# EAGLE design Altaids (EAGLE 7.6.0)
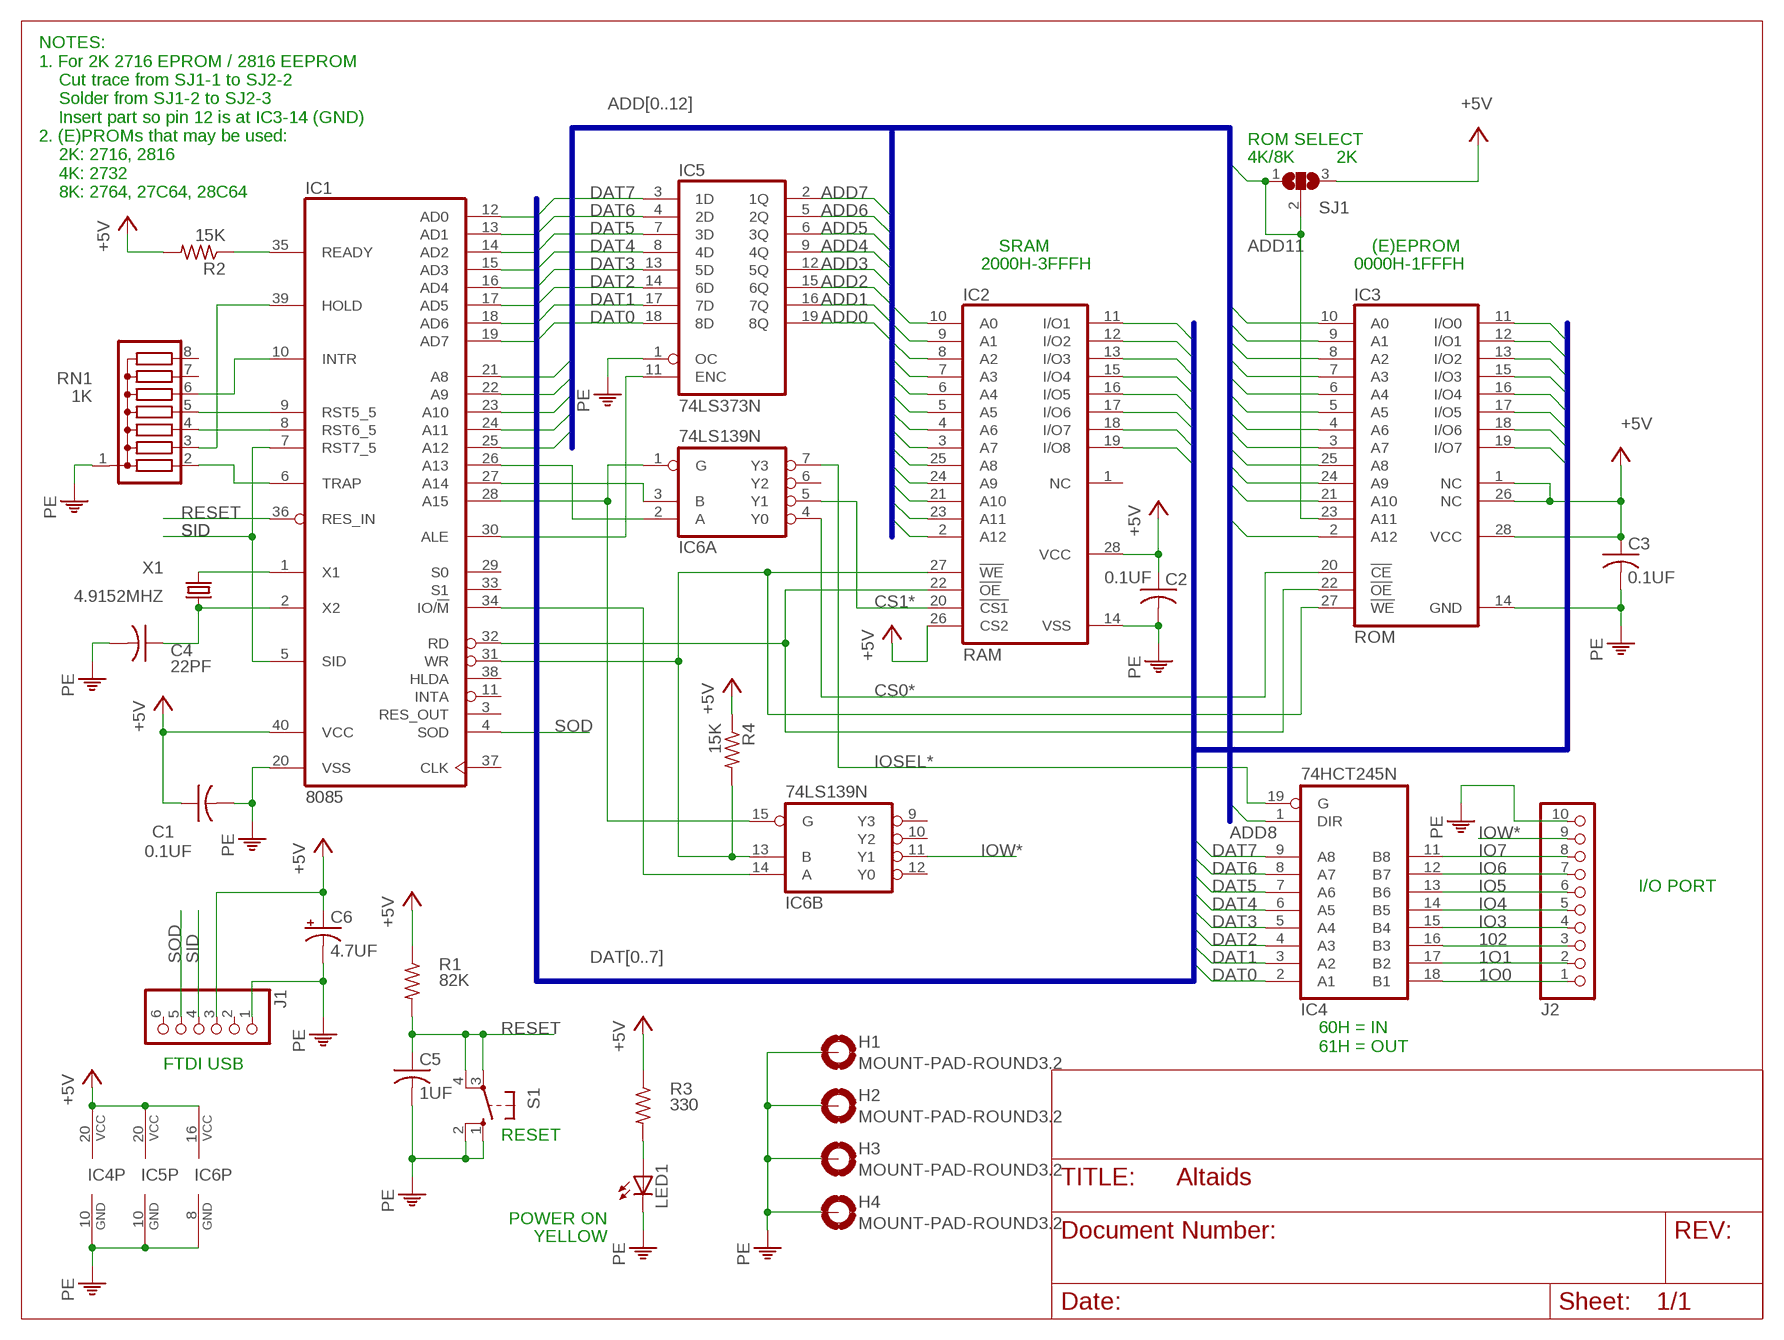
[diagram p0: schematic, sheet 1]

## Parts
C1  0.1UF  C-US025-025X050  [C025-025X050]
C2  0.1UF  C-US025-025X050  [C025-025X050]
C3  0.1UF  C-US025-025X050  [C025-025X050]
C4  22PF  C-US025-025X050  [C025-025X050]
C5  1UF  C-US025-025X050  [C025-025X050]
C6  4.7UF  CAP_POLPTH1  [CPOL-RADIAL-100UF-25V]
H1  MOUNT-PAD-ROUND3.2  [3,2-PAD]
H2  MOUNT-PAD-ROUND3.2  [3,2-PAD]
H3  MOUNT-PAD-ROUND3.2  [3,2-PAD]
H4  MOUNT-PAD-ROUND3.2  [3,2-PAD]
IC1  8085  [DIL40]
IC2  RAM  6264A  [DIL28-6]
IC3  ROM  28C64C  [DIL28-6]
IC4  74HCT245N  74LS245N  [DIL20]
IC5  74LS373N  [DIL20]
IC6  74LS139N  [DIL16]
J1  PINHD-1X6  [1X06]
J2  PINHD-1X10  [1X10]
LED1  LED3MM  [LED3MM]
R1  82K  R-US_0207/10  [0207/10]
R2  15K  R-US_0207/10  [0207/10]
R3  330  R-US_0207/10  [0207/10]
R4  15K  R-US_0207/10  [0207/10]
RN1  1K  G07R  [SIL8]
S1  10-XX  [B3F-10XX]
SJ1  SJ2W  [SJ_2]
X1  4.9152MHZ  CRYSTALHC49U-H  [HC49U-H]

## Nets
1O0: IC4.18(B1) J2.1
1O1: IC4.17(B2) J2.2
102: IC4.16(B3) J2.3
+5V: C1.1 C2.1 C3.1 C6.1(+) IC1.40(VCC) IC2.26(CS2) IC2.28(VCC) IC3.1(NC) IC3.26(NC) IC3.28(VCC) IC4.20(VCC) IC5.20(VCC) IC6.16(P:VCC) J1.3 R1.1 R2.2 R3.1 R4.1 SJ1.3
ADD0: IC2.10(A0) IC3.10(A0) IC5.19(8Q)
ADD1: IC2.9(A1) IC3.9(A1) IC5.16(7Q)
ADD2: IC2.8(A2) IC3.8(A2) IC5.15(6Q)
ADD3: IC2.7(A3) IC3.7(A3) IC5.12(5Q)
ADD4: IC2.6(A4) IC3.6(A4) IC5.9(4Q)
ADD5: IC2.5(A5) IC3.5(A5) IC5.6(3Q)
ADD6: IC2.4(A6) IC3.4(A6) IC5.5(2Q)
ADD7: IC2.3(A7) IC3.3(A7) IC5.2(1Q)
ADD8: IC1.21(A8) IC2.25(A8) IC3.25(A8) IC4.1(DIR)
ADD9: IC1.22(A9) IC2.24(A9) IC3.24(A9)
ADD10: IC1.23(A10) IC2.21(A10) IC3.21(A10)
ADD11: IC1.24(A11) IC2.23(A11) IC3.23(A11) SJ1.1 SJ1.2
ADD12: IC1.25(A12) IC2.2(A12) IC3.2(A12)
CS0*: IC3.20(!CE) IC6.4(A:Y0)
CS1*: IC2.20(!CS1) IC6.5(A:Y1)
DAT0: IC1.12(AD0) IC2.11(I/O1) IC3.11(I/O0) IC4.2(A1) IC5.18(8D)
DAT1: IC1.13(AD1) IC2.12(I/O2) IC3.12(I/O1) IC4.3(A2) IC5.17(7D)
DAT2: IC1.14(AD2) IC2.13(I/O3) IC3.13(I/O2) IC4.4(A3) IC5.14(6D)
DAT3: IC1.15(AD3) IC2.15(I/O4) IC3.15(I/O3) IC4.5(A4) IC5.13(5D)
DAT4: IC1.16(AD4) IC2.16(I/O5) IC3.16(I/O4) IC4.6(A5) IC5.8(4D)
DAT5: IC1.17(AD5) IC2.17(I/O6) IC3.17(I/O5) IC4.7(A6) IC5.7(3D)
DAT6: IC1.18(AD6) IC2.18(I/O7) IC3.18(I/O6) IC4.8(A7) IC5.4(2D)
DAT7: IC1.19(AD7) IC2.19(I/O8) IC3.19(I/O7) IC4.9(A8) IC5.3(1D)
IO3: IC4.15(B4) J2.4
IO4: IC4.14(B5) J2.5
IO5: IC4.13(B6) J2.6
IO6: IC4.12(B7) J2.7
IO7: IC4.11(B8) J2.8
IOSEL*: IC4.19(G) IC6.7(A:Y3)
IOW*: IC6.11(B:Y1) J2.9
N$1: IC1.35(READY) R2.1
N$2: IC1.39(HOLD) RN1.3
N$3: IC1.10(INTR) RN1.6
N$4: IC1.9(RST5_5) RN1.5
N$5: IC1.8(RST6_5) RN1.4
N$6: IC1.6(TRAP) RN1.2
N$7: IC1.28(A15) IC6.1(A:G) IC6.15(B:G)
N$8: IC1.31(WR) IC2.27(!WE) IC3.27(!WE) IC6.13(B:B) R4.2
N$16: LED1.A R3.2
N$17: C4.1 IC1.2(X2) X1.1
N$18: IC1.1(X1) X1.2
N$20: IC1.34(IO/!M) IC6.14(B:A)
N$21: IC1.30(ALE) IC5.11(ENC)
N$23: IC1.27(A14) IC6.3(A:B)
N$24: IC1.26(A13) IC6.2(A:A)
N$25: IC1.32(RD) IC2.22(!OE) IC3.22(!OE)
PE: C1.2 C2.2 C3.2 C4.2 C5.2 C6.2(-) H1.B3,2(MOUNT) H2.B3,2(MOUNT) H3.B3,2(MOUNT) H4.B3,2(MOUNT) IC1.20(VSS) IC2.14(VSS) IC3.14(GND) IC4.10(GND) IC5.1(OC) IC5.10(GND) IC6.8(P:GND) J1.1 J2.10 LED1.K(C) RN1.1 S1.1(S) S1.2(S1)
RESET: C5.1 IC1.36(RES_IN) R1.2 S1.3(P) S1.4(P1)
SID: IC1.5(SID) IC1.7(RST7_5) J1.4
SOD: IC1.4(SOD) J1.5
Unconnected: IC1.3(RES_OUT) IC1.11(INTA) IC1.29(S0) IC1.33(S1) IC1.37(CLK) IC1.38(HLDA) IC2.1(NC) IC6.6(A:Y2) IC6.9(B:Y3) IC6.10(B:Y2) IC6.12(B:Y0) J1.2 J1.6 RN1.7 RN1.8

## Buses
ADD[0..12]
DAT[0..7]

## Notes on the sheet
- ROM SELECT
- 4K/8K | 2K
- NOTES:
  1. For 2K 2716 EPROM / 2816 EEPROM
      Cut trace from SJ1-1 to SJ2-2
      Solder from SJ1-2 to SJ2-3
      Insert part so pin 12 is at IC3-14 (GND)
  2. (E)PROMs that may be used:
      2K: 2716, 2816
      4K: 2732
      8K: 2764, 27C64, 28C64
- SRAM | (E)EPROM
- 2000H-3FFFH | 0000H-1FFFH
- I/O PORT
- 60H = IN
  61H = OUT
- FTDI USB
- RESET
- POWER ON
- YELLOW

## Library data of the parts
C1-C5 = rcl:C-US: CAPACITOR, American symbol
C6 = SparkFun-Capacitors:CAP_POL: Capacitor Polarized These are standard SMD and PTH capacitors. Normally 10uF, 47uF, and 100uF in electrolytic and tantalum varieties. Always verify the external diameter of the through hole cap, it varies with capacity, voltage, and manufacturer. The EIA devices should be standard.
H1-H4 = holes:MOUNT-PAD-ROUND: MOUNTING PAD, round
IC1 = micro-intel:8085: MICROCOMPUTER/PERIPHERAL DEVICE; OC_FARNELL: unknown; OC_NEWARK: unknown
IC2 = memory-hitachi:6264A: MEMORY; OC_FARNELL: 283605; OC_NEWARK: unknown
IC3 = memory-nec:28C64C: MEMORY; MPN: AT28C64B-15PU; OC_FARNELL: 1095784; OC_NEWARK: 96K6557
IC4 = 74xx-us:74*245: Octal BUS TRANSCEIVER, 3-state
IC5 = 74xx-us:74*373: Octal D type transparent LATCH, edge triggered
IC6 = 74xx-us:74*139: Dual 2-line to 4-line DECODER/DEMULTIPLEXER
J1 = pinhead:PINHD-1X6: PIN HEADER
J2 = pinhead:PINHD-1X10: PIN HEADER
LED1 = led:LED: LED OSRAM: - CHIPLED LG R971, LG N971, LY N971, LG Q971, LY Q971, LO R971, LY R971 LH N974, LH R974 LS Q976, LO Q976, LY Q976 LO Q996 - Hyper CHIPLED LW Q18S LB Q993, LB Q99A, LB R99A - SideLED LS A670, LO A670, LY A670, LG A670, LP A670 LB A673, LV A673, LT A673, LW A673 LH A674 LY A675 LS A676, LA A676, LO A676, LY A676, LW A676 LS A679, LY A679, LG A679 - Hyper Micro SIDELED® LS Y876, LA Y876, LO Y876, LY Y876 LT Y87S - SmartLED LW L88C, LW L88S LB L89C, LB L89S, LG L890 LS L89K, LO L89K, LY L89K LS L896, LA L896, LO L896, LY L896 - TOPLED LS T670, LO T670, LY T670, LG T670, LP T670 LSG T670, LSP T670, LSY T670, LOP T670, LYG T670 LG T671, LOG T671, LSG T671 LB T673, LV T673, LT T673, LW T673 LH T674 LS T676, LA T676, LO T676, LY T676, LB T676, LH T676, LSB T676, LW T676 LB T67C, LV T67C, LT T67C, LS T67K, LO T67K, LY T67K, LW E67C LS E67B, LA E67B, LO E67B, LY E67B, LB E67C, LV E67C, LT E67C LW T67C LS T679, LY T679, LG T679 LS T770, LO T770, LY T770, LG T770, LP T770 LB T773, LV T773, LT T773, LW T773 LH T774 LS E675, LA E675, LY E675, LS T675 LS T776, LA T776, LO T776, LY T776, LB T776 LHGB T686 LT T68C, LB T68C - Hyper Mini TOPLED® LB M676 - Mini TOPLED Santana® LG M470 LS M47K, LO M47K, LY M47K Source: http://www.osram.convergy.de LUXEON: - LUMILED® LXK2-PW12-R00, LXK2-PW12-S00, LXK2-PW14-U00, LXK2-PW14-V00 LXK2-PM12-R00, LXK2-PM12-S00, LXK2-PM14-U00 LXK2-PE12-Q00, LXK2-PE12-R00, LXK2-PE12-S00, LXK2-PE14-T00, LXK2-PE14-U00 LXK2-PB12-K00, LXK2-PB12-L00, LXK2-PB12-M00, LXK2-PB14-N00, LXK2-PB14-P00, LXK2-PB14-Q00 LXK2-PR12-L00, LXK2-PR12-M00, LXK2-PR14-Q00, LXK2-PR14-R00 LXK2-PD12-Q00, LXK2-PD12-R00, LXK2-PD12-S00 LXK2-PH12-R00, LXK2-PH12-S00 LXK2-PL12-P00, LXK2-PL12-Q00, LXK2-PL12-R00 Source: www.luxeon.com KINGBRIGHT: KA-3528ASYC Source: www.kingbright.com
R1-R4 = rcl:R-US_: RESISTOR, American symbol
RN1 = resistor-sil:G07R: SIL RESISTOR; OC_FARNELL: unknown; OC_NEWARK: unknown
S1 = switch-omron:10-XX: OMRON SWITCH; MPN: B3F-1000; OC_FARNELL: 176432; OC_NEWARK: 36M3542
SJ1 = jumper:SJ2W: SMD solder JUMPER
X1 = crystal:CRYSTAL: CRYSTAL; OC_FARNELL: 1666973; OC_NEWARK: unknown

## Board
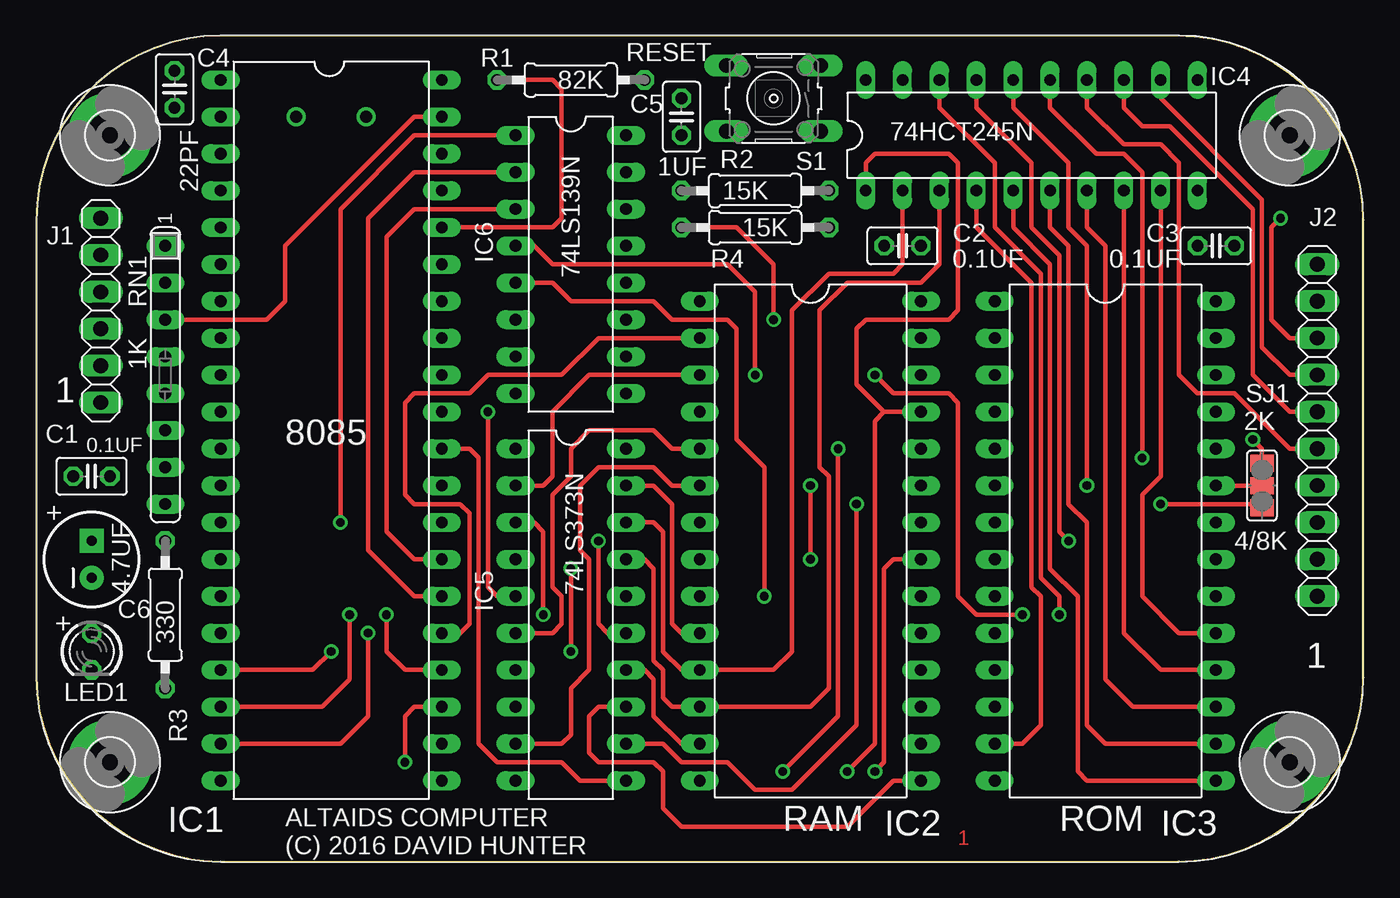
[diagram p1: board, top side]
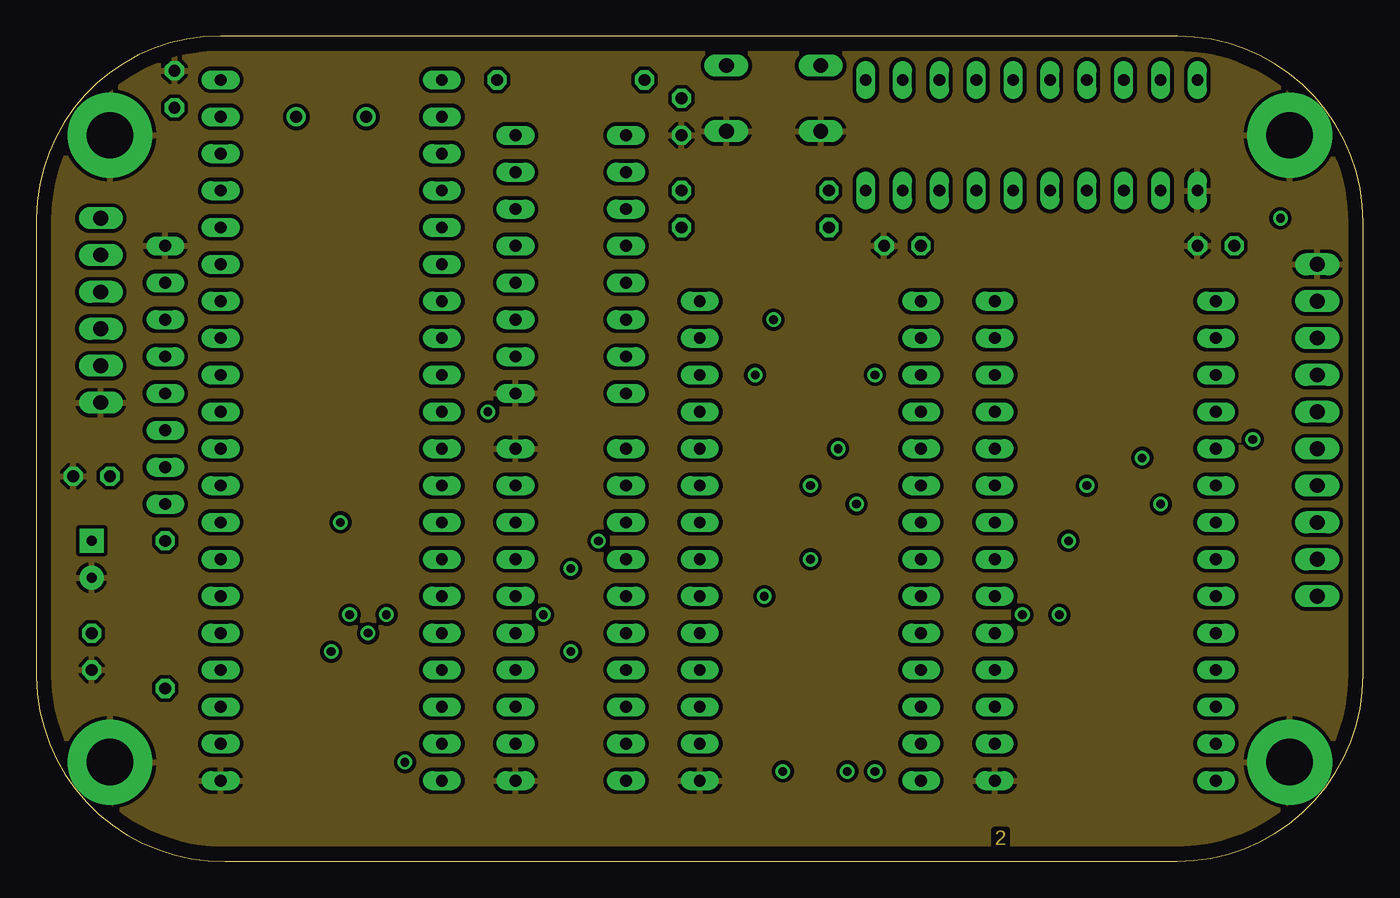
[diagram p2: board, inner layer Route2]
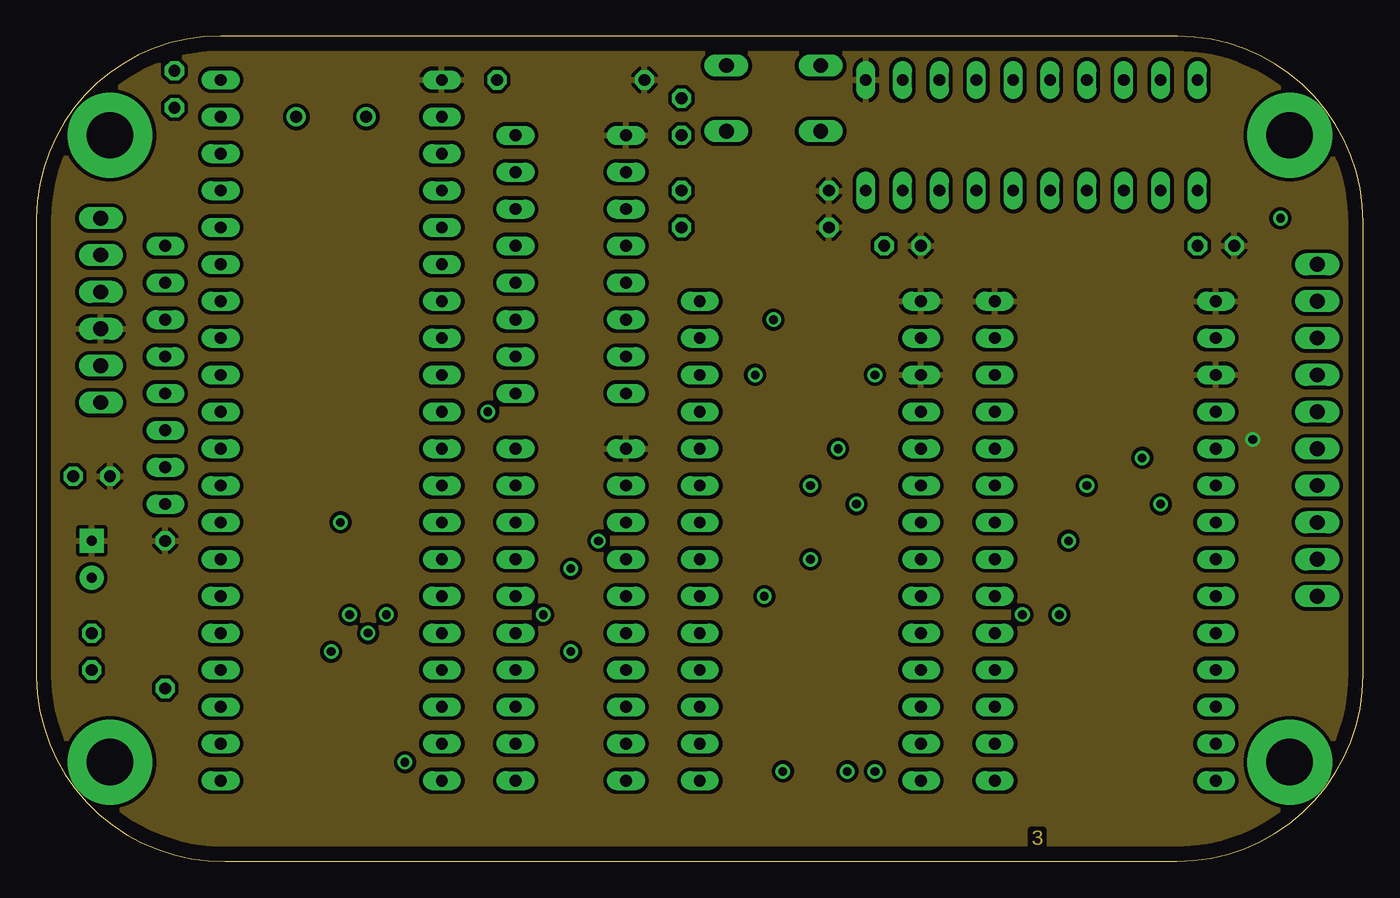
[diagram p3: board, inner layer Route15]
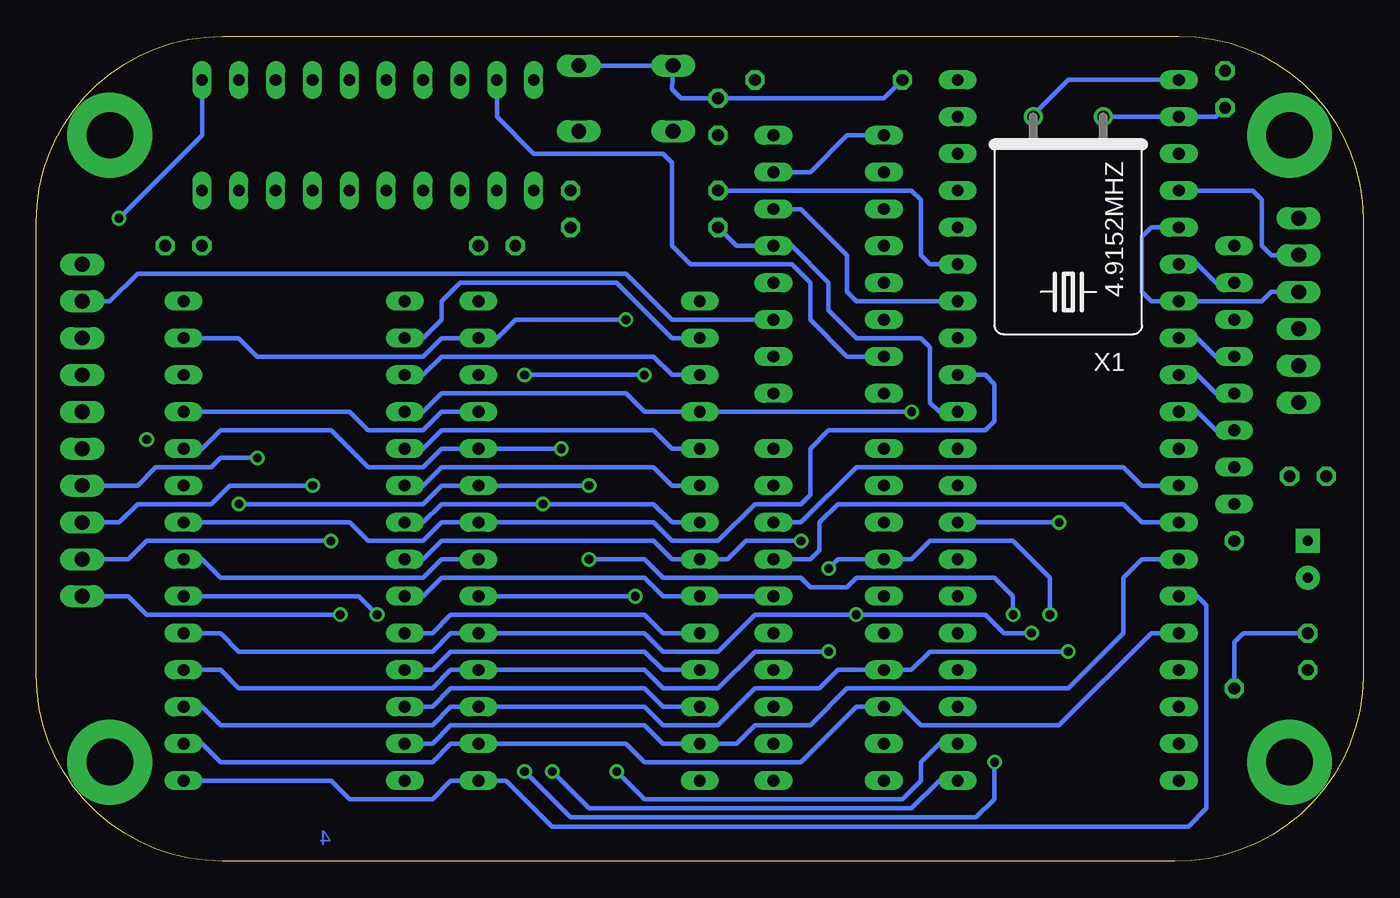
[diagram p4: board, bottom side, seen from below]

Size 91.43 x 56.82 mm. Coordinates in mm from the lower left corner, seen from the top.
Outline: 0,44.29 0,12.71 arc90 13.03,0 78.58,0 arc90 91.43,12.85 91.43,44.02 arc90 78.63,56.82 12.69,56.82 arc90 0,44.29
Copper layers (1*2+15*16): Top 0.035mm / dielectric 0.23mm / Route2 0.035mm / dielectric 0.93mm / Route15 0.035mm / dielectric 0.23mm / Bottom 0.035mm
Design rules "4layer": minimum track width 10mil, minimum drill 24mil, track to track 10mil, track to pad 10mil, pad to pad 10mil, via to via 10mil, smd to smd 8mil, copper to edge 40mil, drill to drill 8mil, minimum pad ring 10mil, minimum via ring 8mil, stop-mask expansion 4mil, vias tented up to drill 0mil, thermal gap 10mil

### Footprints (pad centres in the part's own frame; a part is rotated, then mirrored left to right if it is on the bottom)
C025-025X050 = drill 0.813 octagon: 1 -1.27,0; 2 1.27,0
CPOL-RADIAL-100UF-25V = drill 0.7 pad 1.651 square: 1 1.27,0 | drill 0.7 pad 1.651: 2 -1.27,0
3,2-PAD = drill 3.2 pad 5.842: B3,2 0,0
DIL40 = drill 0.813 long: 1 -24.13,-7.62; 2 -21.59,-7.62; 3 -19.05,-7.62; 4 -16.51,-7.62; 5 -13.97,-7.62; 6 -11.43,-7.62; 7 -8.89,-7.62; 8 -6.35,-7.62; 9 -3.81,-7.62; 10 -1.27,-7.62; 11 1.27,-7.62; 12 3.81,-7.62; 13 6.35,-7.62; 14 8.89,-7.62; 15 11.43,-7.62; 16 13.97,-7.62; 17 16.51,-7.62; 18 19.05,-7.62; 19 21.59,-7.62; 20 24.13,-7.62; 21 24.13,7.62; 22 21.59,7.62; 23 19.05,7.62; 24 16.51,7.62; 25 13.97,7.62; 26 11.43,7.62; 27 8.89,7.62; 28 6.35,7.62; 29 3.81,7.62; 30 1.27,7.62; 31 -1.27,7.62; 32 -3.81,7.62; 33 -6.35,7.62; 34 -8.89,7.62; 35 -11.43,7.62; 36 -13.97,7.62; 37 -16.51,7.62; 38 -19.05,7.62; 39 -21.59,7.62; 40 -24.13,7.62
DIL28-6 = drill 0.813 long: 1 -16.51,-7.62; 2 -13.97,-7.62; 3 -11.43,-7.62; 4 -8.89,-7.62; 5 -6.35,-7.62; 6 -3.81,-7.62; 7 -1.27,-7.62; 8 1.27,-7.62; 9 3.81,-7.62; 10 6.35,-7.62; 11 8.89,-7.62; 12 11.43,-7.62; 13 13.97,-7.62; 14 16.51,-7.62; 15 16.51,7.62; 16 13.97,7.62; 17 11.43,7.62; 18 8.89,7.62; 19 6.35,7.62; 20 3.81,7.62; 21 1.27,7.62; 22 -1.27,7.62; 23 -3.81,7.62; 24 -6.35,7.62; 25 -8.89,7.62; 26 -11.43,7.62; 27 -13.97,7.62; 28 -16.51,7.62
DIL20 = drill 0.813 long: 1 -11.43,-3.81; 2 -8.89,-3.81; 3 -6.35,-3.81; 4 -3.81,-3.81; 5 -1.27,-3.81; 6 1.27,-3.81; 7 3.81,-3.81; 8 6.35,-3.81; 9 8.89,-3.81; 10 11.43,-3.81; 11 11.43,3.81; 12 8.89,3.81; 13 6.35,3.81; 14 3.81,3.81; 15 1.27,3.81; 16 -1.27,3.81; 17 -3.81,3.81; 18 -6.35,3.81; 19 -8.89,3.81; 20 -11.43,3.81
DIL16 = drill 0.813 long: 1 -8.89,-3.81; 2 -6.35,-3.81; 3 -3.81,-3.81; 4 -1.27,-3.81; 5 1.27,-3.81; 6 3.81,-3.81; 7 6.35,-3.81; 8 8.89,-3.81; 9 8.89,3.81; 10 6.35,3.81; 11 3.81,3.81; 12 1.27,3.81; 13 -1.27,3.81; 14 -3.81,3.81; 15 -6.35,3.81; 16 -8.89,3.81
1X06 = drill 1.016 long: 1 -6.35,0; 2 -3.81,0; 3 -1.27,0; 4 1.27,0; 5 3.81,0; 6 6.35,0
1X10 = drill 1.016 long: 1 -11.43,0; 2 -8.89,0; 3 -6.35,0; 4 -3.81,0; 5 -1.27,0; 6 1.27,0; 7 3.81,0; 8 6.35,0; 9 8.89,0; 10 11.43,0
LED3MM = drill 0.813 octagon: A -1.27,0; K 1.27,0
0207/10 = drill 0.813 octagon: 1 -5.08,0; 2 5.08,0
SIL8 = drill 0.813 long: 1 -8.89,0; 2 -6.35,0; 3 -3.81,0; 4 -1.27,0; 5 1.27,0; 6 3.81,0; 7 6.35,0; 8 8.89,0
B3F-10XX = drill 1.016 long: 1 -3.251,2.261; 2 3.251,2.261; 3 -3.251,-2.261; 4 3.251,-2.261
SJ_2 = smd 1.168 x 1.6: 1 -1.524,0; 2 0,0; 3 1.524,0
HC49U-H = drill 0.813: 1 -2.413,-5.08; 2 2.413,-5.08

### Placement (x,y rotation side)
C1  3.81,26.51 180 top
C2  59.69,42.39 180 top
C3  81.28,42.39 180 top
C4  9.53,53.18 90 top
C5  44.45,51.28 270 top
C6  3.81,20.8 90 top
H1  5.08,6.83 0 top
H2  5.08,50.01 0 top
H3  86.36,50.01 0 top
H4  86.36,6.83 0 top
IC1  20.32,29.69 270 top
IC2  53.34,22.07 270 top
IC3  73.66,22.07 270 top
IC4  68.58,50.01 0 top
IC5  36.83,16.99 270 top
IC6  36.83,41.12 270 top
J1  4.45,37.94 90 top
J2  88.27,29.69 90 top
LED1  3.81,14.45 270 top
R1  36.83,53.82 180 top
R2  49.53,46.2 0 top
R3  8.89,16.99 270 top
R4  49.53,43.66 180 top
RN1  8.89,33.5 270 top
S1  50.8,52.55 180 top
SJ1  84.45,25.88 90 top
U$1  [ALTOIDSTIN]  45.72,28.42 0 top
X1  20.32,46.2 180 bottom

### Tracks (layer width: path | path; a pad name or v marks a point on that pad's centre or on a via)
1O0  (via drill 0.6)
  Top 0.305: IC4.18 62.23,51.91 66.04,48.1 66.04,43.66 69.22,40.48 69.22,19.53 70.48,18.26 v70.48,16.99
  Bottom 0.305: v70.48,16.99 83.82,16.99 85.09,18.26 J2.1
1O1  (via drill 0.6)
  Top 0.305: v71.12,22.07 70.48,22.7 70.48,41.75 68.58,43.66 68.58,48.1 64.77,51.91 IC4.17
  Bottom 0.305: J2.2 85.09,20.8 83.82,22.07 v71.12,22.07
102  (via drill 0.6)
  Top 0.305: v72.39,25.88 72.39,42.39 71.12,43.66 71.12,48.1 67.31,51.91 IC4.16
  Bottom 0.305: J2.3 85.73,23.34 84.45,24.61 79.38,24.61 78.11,25.88 v72.39,25.88
+5V  (via drill 0.6)
  Top 0.305: SJ1.3 84.45,28.42 v83.82,29.05
  pour Route15: 10.16,56.36 81.28,56.36 82.55,55.72 85.73,54.45 89.06,50.48 89.85,49.05 90.96,46.2 91.12,44.93 90.96,11.91 88.9,5.56 85.09,2.38 81.28,0.48 10.16,0.48 4.92,3.02 2.38,6.03 0.95,9.05 0.32,10.64 0.32,45.56 1.91,50.01 3.18,51.91 5.87,54.45
ADD0
  Top 0.305: IC2.10 44.45,15.72 43.82,16.35 43.82,24.61 42.55,25.88 IC5.19
  Bottom 0.305: IC3.10 64.14,15.72 62.86,16.99 49.53,16.99 48.26,15.72 IC2.10
ADD1
  Bottom 0.305: IC3.9 64.77,18.26 63.5,19.53 49.53,19.53 48.26,18.26 IC2.9 IC5.16
ADD2  (via drill 0.6)
  Top 0.305: IC5.15 39.37,15.72 38.73,16.35 v38.73,22.07
  Bottom 0.305: IC3.8 64.77,20.8 63.5,22.07 48.9,22.07 47.62,20.8 IC2.8 43.82,20.8 42.55,22.07 v38.73,22.07
ADD3  (via drill 0.6)
  Top 0.305: IC5.12 43.18,8.1 44.45,6.83 47.62,6.83 49.53,4.92 52.07,4.92 56.52,9.37 v56.52,24.61
  Bottom 0.305: IC3.7 64.77,23.34 63.5,24.61 v56.52,24.61 48.9,24.61 47.62,23.34 IC2.7
ADD4
  Top 0.305: IC2.6 43.82,25.88 42.55,27.15 38.73,27.15 37.47,25.88 37.47,21.43 38.1,20.8 38.1,13.18 36.83,11.91 36.83,8.73 36.2,8.1 IC5.9
  Bottom 0.305: IC3.6 64.77,25.88 63.5,27.15 48.9,27.15 47.62,25.88 IC2.6
ADD5
  Top 0.305: IC2.5 43.82,28.42 42.55,29.69 38.1,29.69 36.83,28.42 36.83,26.51 35.56,25.24 35.56,18.89 36.2,18.26 36.2,16.35 35.56,15.72 IC5.6
  Bottom 0.305: IC3.5 64.77,28.42 63.5,29.69 48.9,29.69 47.62,28.42 IC2.5
ADD6  (via drill 0.6)
  Top 0.305: v31.12,30.96 31.12,18.89 31.75,18.26 IC5.5
  Bottom 0.305: IC3.4 64.77,30.96 63.5,32.23 50.8,32.23 49.53,30.96 IC2.4 v31.12,30.96
ADD7
  Top 0.305: IC2.3 38.1,33.5 35.56,30.96 35.56,26.51 34.93,25.88 IC5.2
  Bottom 0.305: IC3.3 64.77,33.5 63.5,34.77 48.9,34.77 47.62,33.5 IC2.3
ADD8  (via drill 0.6)
  Top 0.305: IC2.25 58.42,30.96 | 58.42,30.96 56.52,32.86 56.52,36.67 57.15,37.31 62.86,37.31 63.5,37.94 63.5,48.1 62.86,48.74 57.79,48.74 57.15,48.1 IC4.1 | v55.88,6.19 57.79,8.1 57.79,30.32 58.42,30.96
  Bottom 0.305: IC3.25 69.85,30.96 68.58,29.69 64.77,29.69 63.5,30.96 IC2.25 | IC1.21 29.21,5.56 31.12,3.65 53.34,3.65 v55.88,6.19
ADD9  (via drill 0.6)
  Top 0.305: v51.44,6.19 55.25,10 v55.25,28.42
  Bottom 0.305: IC3.24 80.01,28.42 78.74,29.69 71.12,29.69 68.58,27.15 64.77,27.15 63.5,28.42 IC2.24 v55.25,28.42 | IC1.22 29.21,8.1 30.48,6.83 30.48,5.56 31.75,4.29 49.53,4.29 v51.44,6.19
ADD10  (via drill 0.6)
  Top 0.305: IC2.21 59.06,20.8 58.42,20.16 58.42,6.83 v57.79,6.19 | v25.4,6.83 25.4,10 26.03,10.64 IC1.23
  Bottom 0.305: IC3.21 80.01,20.8 78.74,19.53 64.77,19.53 63.5,20.8 IC2.21 | v57.79,6.19 54.61,3.02 26.67,3.02 25.4,4.29 v25.4,6.83
ADD11  (via drill 0.6)
  Top 0.305: IC1.24 25.4,13.18 24.13,14.45 v24.13,16.99 | v53.34,20.8 v53.34,25.88 | IC3.23 SJ1.2 SJ1.1 83.82,24.61 v77.47,24.61
  Bottom 0.305: v24.13,16.99 24.13,18.26 25.4,19.53 34.93,19.53 35.56,18.89 38.1,18.89 38.73,19.53 48.26,19.53 49.53,20.8 v53.34,20.8 | v53.34,25.88 IC2.23 63.5,25.88 64.77,24.61 v77.47,24.61
ADD12
  Top 0.305: IC1.25 29.21,15.72 29.84,16.35 29.84,23.97 29.21,24.61 26.03,24.61 25.4,25.24 25.4,31.59 26.03,32.23 29.84,32.23 31.12,33.5 36.2,33.5 38.73,36.04 IC2.2
  Bottom 0.305: IC3.2 64.77,36.04 63.5,37.31 63.5,38.58 62.23,39.85 51.44,39.85 47.62,36.04 IC2.2
CS0*  (via drill 0.6)
  Top 0.305: v67.95,16.99 64.77,16.99 63.5,18.26 63.5,31.59 62.86,32.23 59.06,32.23 v57.79,33.5 | v49.53,33.5 49.53,39.21 47.62,41.12 35.56,41.12 34.29,42.39 IC6.4
  Bottom 0.305: IC3.20 69.22,18.26 v67.95,16.99 | v57.79,33.5 v49.53,33.5
CS1*  (via drill 0.6)
  Top 0.305: IC6.5 35.56,39.85 36.83,38.58 42.55,38.58 43.82,37.31 47.62,37.31 48.26,36.67 48.26,29.05 50.16,27.15 v50.16,18.26
  Bottom 0.305: IC2.20 v50.16,18.26
DAT0
  Top 0.305: IC4.2 59.69,41.12 59.06,40.48 54.61,40.48 52.07,37.94 52.07,14.45 50.8,13.18 IC2.11 44.45,13.18 43.18,14.45 43.18,22.7 42.55,23.34 IC5.18
  Bottom 0.305: IC3.11 64.14,13.18 62.86,14.45 49.53,14.45 48.26,13.18 IC2.11 | IC1.12 15.24,25.88 16.51,27.15 34.93,27.15 38.73,23.34 IC5.18
DAT1
  Top 0.305: IC4.3 62.23,41.12 60.96,39.85 55.88,39.85 53.98,37.94 53.98,27.15 54.61,26.51 54.61,11.91 53.34,10.64 IC2.12 43.82,10.64 43.18,11.27 43.18,13.18 42.55,13.81 42.55,20.16 41.91,20.8 IC5.17
  Bottom 0.305: IC3.12 64.14,10.64 62.86,11.91 49.53,11.91 48.26,10.64 IC2.12 | IC1.13 15.24,23.34 16.51,24.61 36.2,24.61 37.47,23.34 37.47,21.43 38.1,20.8 IC5.17
DAT2
  Top 0.305: IC2.13 44.45,8.1 42.55,10 42.55,12.54 41.91,13.18 IC5.14 | IC4.4 64.77,43.66 68.58,39.85 68.58,18.89 69.22,18.26 69.22,9.37 67.95,8.1 IC3.13
  Bottom 0.305: IC3.13 64.14,8.1 62.86,9.37 49.53,9.37 48.26,8.1 IC2.13 43.18,8.1 41.91,9.37 38.1,9.37 35.56,11.91 20.32,11.91 16.51,15.72 16.51,19.53 15.24,20.8 IC1.14
  Bottom 0.406: 13.97,20.8 IC1.14
DAT3
  Top 0.305: IC4.5 67.31,43.66 69.85,41.12 69.85,20.16 71.75,18.26 71.75,6.19 72.39,5.56 IC3.15 | IC5.13 38.73,10.64 38.1,10 38.1,7.46 38.73,6.83 42.55,6.83 43.18,6.19 43.18,3.65 44.45,2.38 55.88,2.38 59.06,5.56 IC2.15
  Bottom 0.305: IC3.15 71.12,5.56 69.85,4.29 64.14,4.29 62.86,5.56 IC2.15 59.06,5.56 55.88,2.38 12.06,2.38 10.79,3.65 10.79,17.62 11.43,18.26 IC1.15
DAT4
  Top 0.305: IC4.6 69.85,43.66 71.12,42.39 71.12,24.61 72.39,23.34 72.39,9.37 73.66,8.1 IC3.16
  Bottom 0.305: IC3.16 80.01,8.1 78.74,6.83 64.14,6.83 62.86,8.1 IC2.16 50.8,8.1 49.53,6.83 38.73,6.83 34.93,10.64 IC5.8 31.75,10.64 30.48,9.37 20.95,9.37 14.6,15.72 IC1.16
DAT5  (via drill 0.6)
  Top 0.305: IC4.7 72.39,43.66 73.66,42.39 73.66,12.54 75.56,10.64 IC3.17 | v20.32,14.45 19.05,13.18 IC1.17
  Bottom 0.305: IC3.17 80.01,10.64 78.74,9.37 64.14,9.37 62.86,10.64 IC2.17 49.53,10.64 48.26,9.37 44.45,9.37 41.91,11.91 37.47,11.91 36.2,13.18 IC5.7 31.12,13.18 29.84,14.45 v20.32,14.45
DAT6  (via drill 0.6)
  Top 0.305: IC1.18 19.69,10.64 21.59,12.54 v21.59,16.99 | IC4.8 74.93,15.72 77.47,13.18 IC3.18 | v36.83,14.45 v36.83,20.16
  Bottom 0.305: IC3.18 78.74,13.18 77.47,11.91 64.14,11.91 62.86,13.18 IC2.18 49.53,13.18 48.26,11.91 44.45,11.91 41.91,14.45 v36.83,14.45 | v36.83,20.16 36.2,20.8 IC5.4 31.12,20.8 29.84,22.07 24.13,22.07 21.59,19.53 v21.59,16.99
DAT7  (via drill 0.6)
  Top 0.305: IC4.9 77.47,26.51 76.2,25.24 76.2,18.26 78.74,15.72 IC3.19 | v34.93,16.99 34.93,22.7 34.29,23.34 IC5.3 | IC1.19 20.95,8.1 22.86,10 v22.86,15.72
  Bottom 0.305: IC3.19 78.74,15.72 77.47,14.45 64.14,14.45 62.86,15.72 IC2.19 49.53,15.72 48.26,14.45 44.45,14.45 41.91,16.99 v34.93,16.99 26.03,16.99 24.77,15.72 v22.86,15.72
IO3  (via drill 0.6)
  Top 0.305: IC4.15 69.85,51.91 73.03,48.74 74.93,48.74 76.2,47.47 v76.2,27.78
  Bottom 0.305: J2.4 84.45,25.88 83.19,27.15 79.38,27.15 78.74,27.78 v76.2,27.78
IO4
  Top 0.305: J2.5 86.36,28.42 82.55,32.23 80.01,32.23 78.74,33.5 78.74,48.1 77.47,49.37 74.93,49.37 72.39,51.91 IC4.14
IO5
  Top 0.305: IC4.13 74.93,51.91 76.2,50.64 78.11,50.64 83.82,44.93 83.82,33.5 86.36,30.96 J2.6
IO6
  Top 0.305: J2.7 86.36,33.5 84.45,35.4 84.45,45.56 77.47,52.55 IC4.12
IO7  (via drill 0.6)
  Top 0.305: J2.8 86.36,36.04 85.09,37.31 85.09,43.66 v85.73,44.29
  Bottom 0.305: IC4.11 80.01,50.01 v85.73,44.29
IOSEL*
  Bottom 0.305: IC4.19 59.69,51.28 57.15,48.74 48.26,48.74 47.62,48.1 47.62,42.39 46.36,41.12 39.37,41.12 38.1,39.85 38.1,37.31 35.56,34.77 IC6.7
IOW*
  Bottom 0.305: J2.9 86.36,38.58 84.45,40.48 50.8,40.48 47.62,37.31 IC6.11
N$1
  Bottom 0.305: IC1.35 29.84,41.12 30.48,41.75 30.48,45.56 31.12,46.2 R2.1
N$2
  Top 0.305: RN1.3 15.87,37.31 17.15,38.58 17.15,42.39 26.03,51.28 IC1.39
N$3
  Bottom 0.305: RN1.6 10.16,29.69 11.43,30.96 IC1.10
N$4
  Bottom 0.305: RN1.5 10.16,32.23 11.43,33.5 IC1.9
N$5
  Bottom 0.305: RN1.4 10.16,34.77 11.43,36.04 IC1.8
N$6
  Bottom 0.305: RN1.2 10.16,39.85 11.43,41.12 IC1.6
N$7  (via drill 0.6)
  Top 0.305: v20.95,23.34 20.95,44.93 26.03,50.01 IC6.1
  Bottom 0.305: IC6.15 38.1,47.47 35.56,50.01 IC6.1 | IC1.28 v20.95,23.34
N$8  (via drill 0.6)
  Top 0.305: v50.8,37.31 50.8,41.12 48.26,43.66 R4.2
  Bottom 0.305: R4.2 43.18,42.39 IC6.13 39.37,42.39 36.83,39.85 36.83,37.94 34.93,36.04 30.48,36.04 29.84,35.4 29.84,31.59 29.21,30.96 IC1.31 | v50.8,37.31 58.42,37.31 59.69,36.04 IC2.27 63.5,36.04 64.77,34.77 76.2,34.77 77.47,36.04 IC3.27
N$16
  Bottom 0.305: LED1.A 8.26,15.72 8.89,15.08 R3.2
N$17
  Bottom 0.305: X1.1 IC1.2 10.16,51.28 C4.1
N$18
  Bottom 0.305: 22.73,51.4 20.32,53.82 IC1.1
  Bottom 0.406: X1.2 22.73,51.4
N$20
  Bottom 0.305: IC1.34 34.93,38.58 35.56,39.21 35.56,41.75 38.73,44.93 IC6.14
N$21
  Top 0.305: IC5.11 37.47,5.56 36.2,6.83 31.75,6.83 30.48,8.1 30.48,27.78 29.84,28.42 IC1.30
N$23
  Top 0.305: IC6.3 26.03,44.93 24.13,43.02 24.13,22.7 26.03,20.8 IC1.27
N$24
  Top 0.305: IC6.2 26.03,47.47 22.86,44.29 22.86,21.43 26.03,18.26 IC1.26
N$25
  Bottom 0.305: IC3.22 69.85,23.34 68.58,22.07 64.77,22.07 63.5,23.34 IC2.22 48.9,23.34 47.62,22.07 44.45,22.07 41.91,24.61 38.73,24.61 38.1,25.24 38.1,28.42 36.83,29.69 26.03,29.69 25.4,30.32 25.4,32.86 26.03,33.5 IC1.32
PE
  pour Route2: 10.79,56.36 81.28,56.36 83.19,55.72 84.45,55.09 86.36,53.82 90.17,49.37 91.44,44.93 90.81,10 88.9,5.56 85.09,1.75 79.38,0.48 10.16,-0.16 5.08,2.38 0.63,10 0.63,47.47 3.18,51.91 6.35,55.09
RESET
  Top 0.305: IC1.36 35.56,43.66 36.2,44.29 36.2,53.18 35.56,53.82 R1.2
  Bottom 0.305: R1.2 33.02,52.55 C5.1 46.99,52.55 47.62,53.18 S1.4 S1.3
SID
  Bottom 0.305: IC1.5 14.6,43.66 15.24,43.02 15.24,39.21 14.6,38.58 IC1.7 6.98,38.58 6.35,39.21 J1.4
SOD
  Bottom 0.305: J1.5 6.35,41.75 6.98,42.39 6.98,45.56 7.62,46.2 IC1.4

### Text on the board
Top: 1
Route2: 2
Route15: 3
Bottom: 4
tNames: RESET | 1 | 2K | + | 4/8K | + | 1 | ALTAIDS COMPUTER / (C) 2016 DAVID HUNTER